# EAGLE design imsensor-v01 (EAGLE 7.5.0)
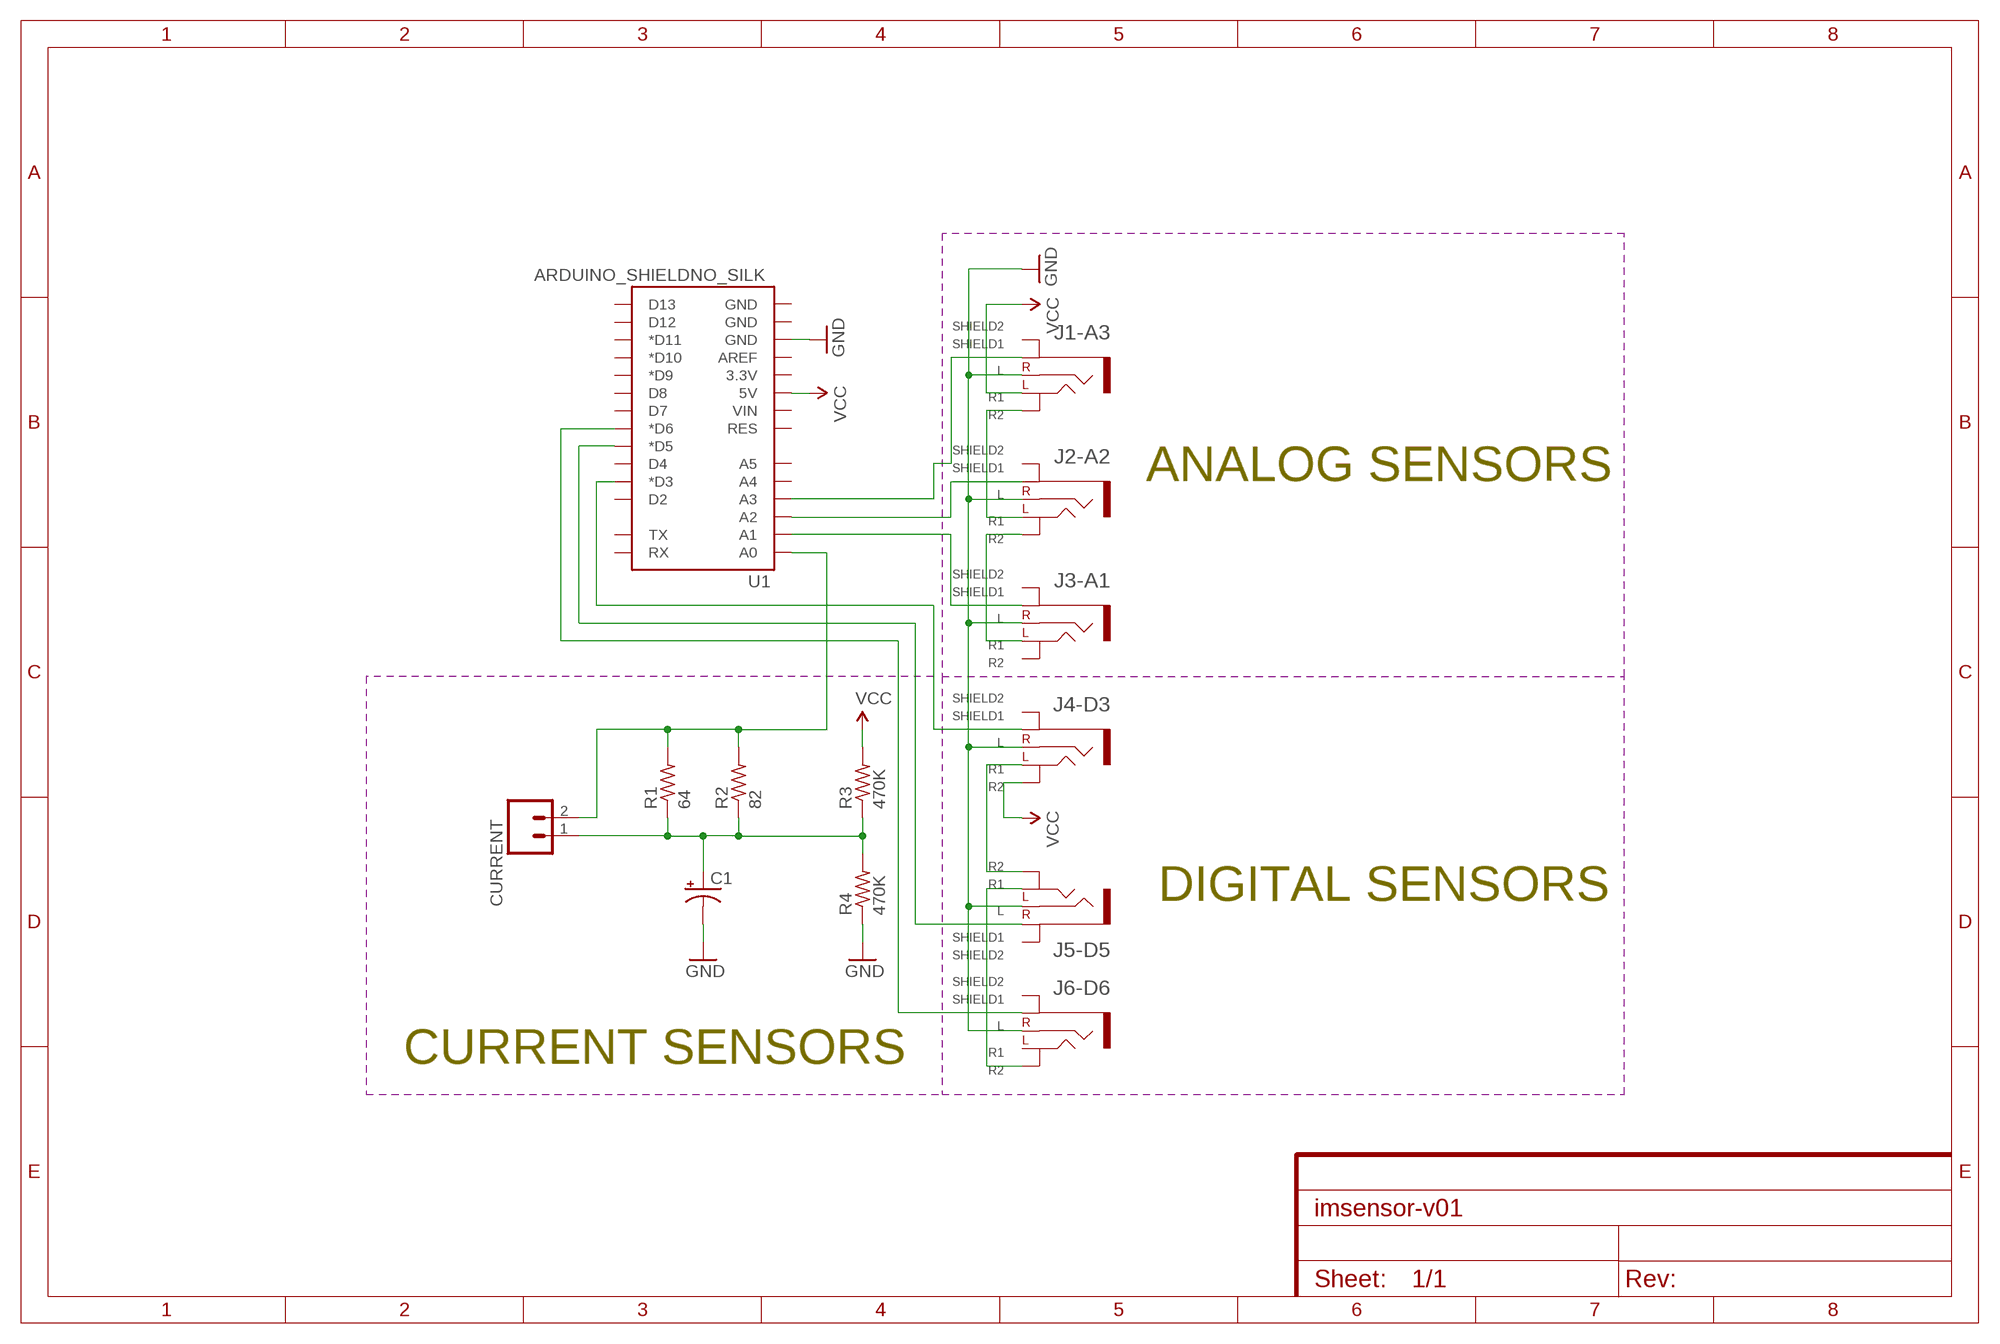
[diagram p0: schematic, sheet 1]
FRAME1 (FRAME-A4L): CNAME: IMSensorNode; CREVISION: REV A; DESIGNER: Jeferson Lima

## Parts
C1  10UF-25V-20%(PTH)  [CPOL-RADIAL-10UF-25V]
CURRENT  M02PTH  [1X02]
J1-A3  PJ-313-SPAD  [PJ-313-5PIN-SMALL]
J2-A2  PJ-313-SPAD  [PJ-313-5PIN-SMALL]
J3-A1  PJ-313-SPAD  [PJ-313-5PIN-SMALL]
J4-D3  PJ-313-SPAD  [PJ-313-5PIN-SMALL]
J5-D5  PJ-313-SPAD  [PJ-313-5PIN-SMALL]
J6-D6  PJ-313-SPAD  [PJ-313-5PIN-SMALL]
R1  64  R-US_0207/10  [0207/10]
R2  82  R-US_0207/10  [0207/10]
R3  470K  R-US_0207/10  [0207/10]
R4  470K  R-US_0207/10  [0207/10]
U1  ARDUINO_SHIELDNO_SILK  [DUEMILANOVE_VIAS]

## Nets
GND: C1.2(-) J1-A3.2(R) J2-A2.2(R) J3-A1.2(R) J4-D3.2(R) J5-D5.2(R) J6-D6.2(R) R4.1 U1.GND@2(GND)
J5: J6-D6.1.1(SHIELD1) U1.D6(*D6)
N$1: J1-A3.3.2(L2) J2-A2.3.1(L1)
N$2: J2-A2.3.2(L2) J3-A1.3.1(L1)
N$3: J1-A3.1.1(SHIELD1) U1.A3
N$4: J2-A2.1.1(SHIELD1) U1.A2
N$5: J3-A1.1.1(SHIELD1) U1.A1
N$6: J5-D5.1.1(SHIELD1) U1.D5(*D5)
N$7: J4-D3.3.1(L1) J5-D5.3.2(L2)
N$8: J4-D3.1.1(SHIELD1) U1.D3(*D3)
N$9: J5-D5.3.1(L1) J6-D6.3.2(L2)
N$10: CURRENT.2 R1.2 R2.2 U1.A0
N$11: C1.1(+) CURRENT.1 R1.1 R2.1 R3.1 R4.2
VCC: J1-A3.3.1(L1) J4-D3.3.2(L2) R3.2 U1.5V
Unconnected: J1-A3.1.2(SHIELD2) J2-A2.1.2(SHIELD2) J3-A1.1.2(SHIELD2) J3-A1.3.2(L2) J4-D3.1.2(SHIELD2) J5-D5.1.2(SHIELD2) J6-D6.1.2(SHIELD2) J6-D6.3.1(L1) U1.3.3V U1.A4 U1.A5 U1.AREF U1.D2 U1.D4 U1.D7 U1.D8 U1.D9(*D9) U1.D10(*D10) U1.D11(*D11) U1.D12 U1.D13 U1.GND@0(GND) U1.GND@1(GND) U1.RES U1.RX U1.TX U1.VIN

## Notes on the sheet
- ANALOG SENSORS
- DIGITAL SENSORS
- CURRENT SENSORS

## Library data of the parts
C1 = SparkFun-Capacitors:10UF-25V-20%(PTH): CAP-08440; PROD_ID: CAP-08440
CURRENT = SparkFun-Connectors:M02: Standard 2-pin 0.1" header. Use with - straight break away headers ( PRT-00116) - right angle break away headers (PRT-00553) - swiss pins (PRT-00743) - machine pins (PRT-00117) - female headers (PRT-00115) Molex polarized connector foot print use with: PRT-08233 with associated crimp pins and housings. 2.54_SCREWTERM for use with PRT-10571. 3.5mm Screw Terminal footprints for PRT-08084 5mm Screw Terminal footprints for use with PRT-08432
J1-A3 J2-A2 J3-A1 J4-D3 J5-D5 J6-D6 = salvador-parts:PJ-313-SPAD: PJ-313 with octagon pads PJ-313 with small octagon pads, good for projects which need small footprints
R1-R4 = resistor:R-US_: RESISTOR, American symbol
U1 = SparkFun-Boards:ARDUINO_SHIELD: Arduino shield footprint

## Board
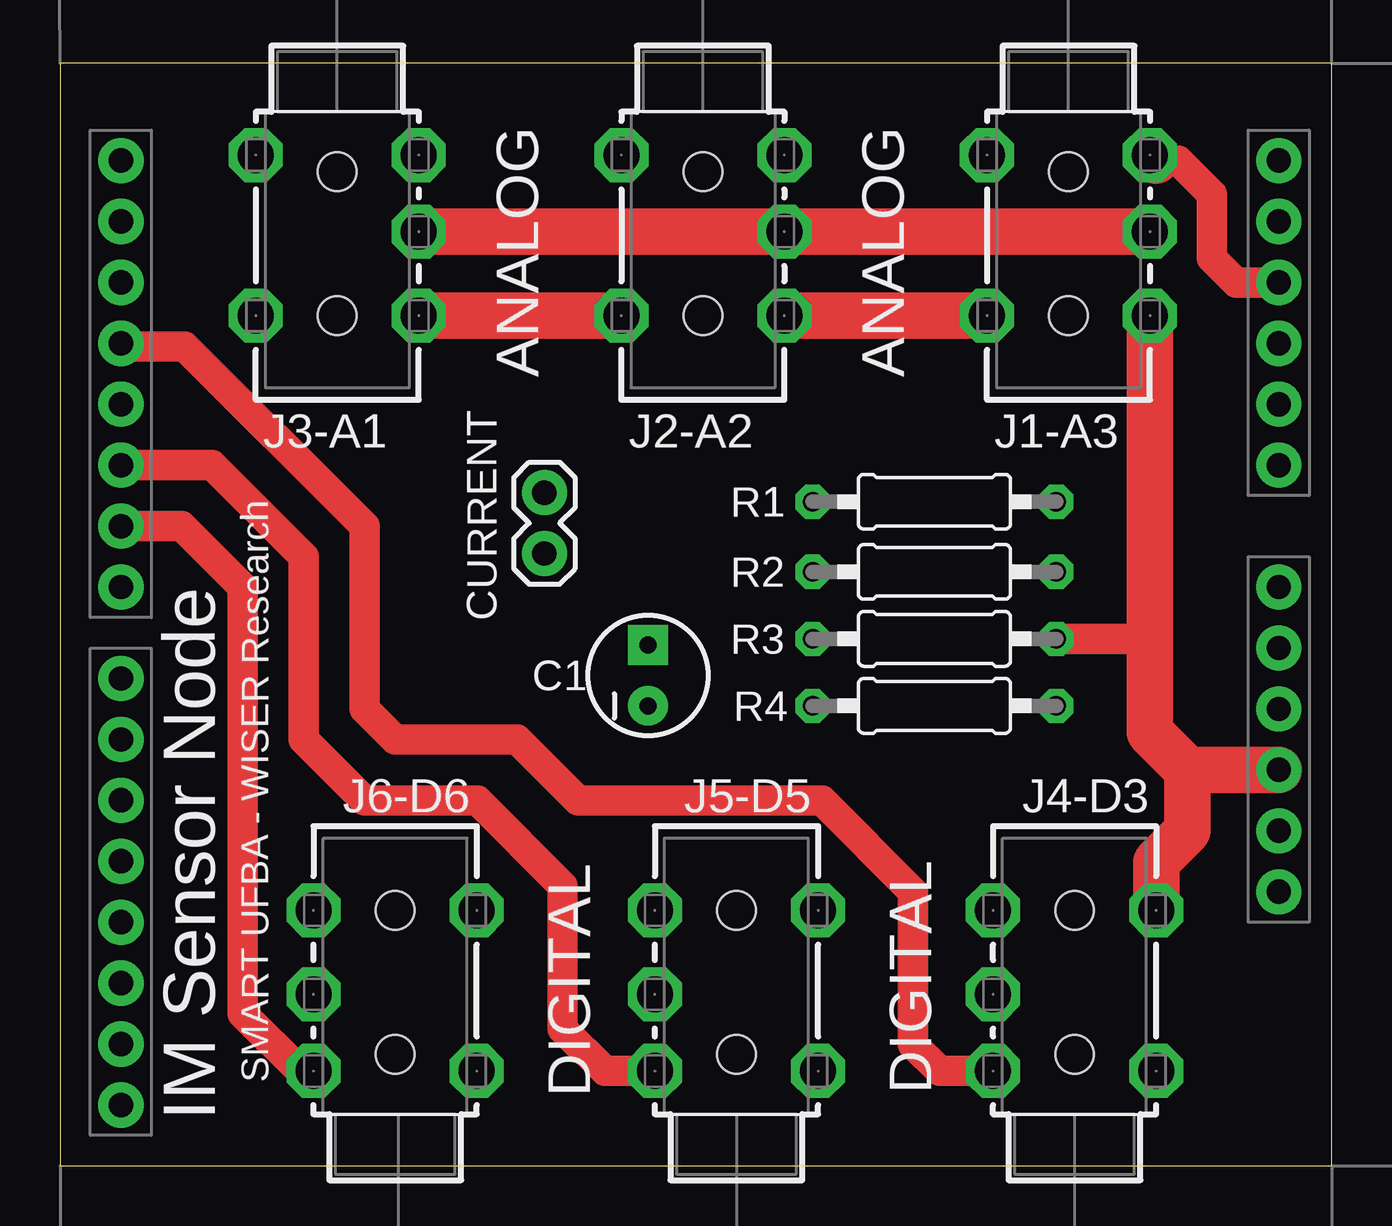
[diagram p1: board, top side]
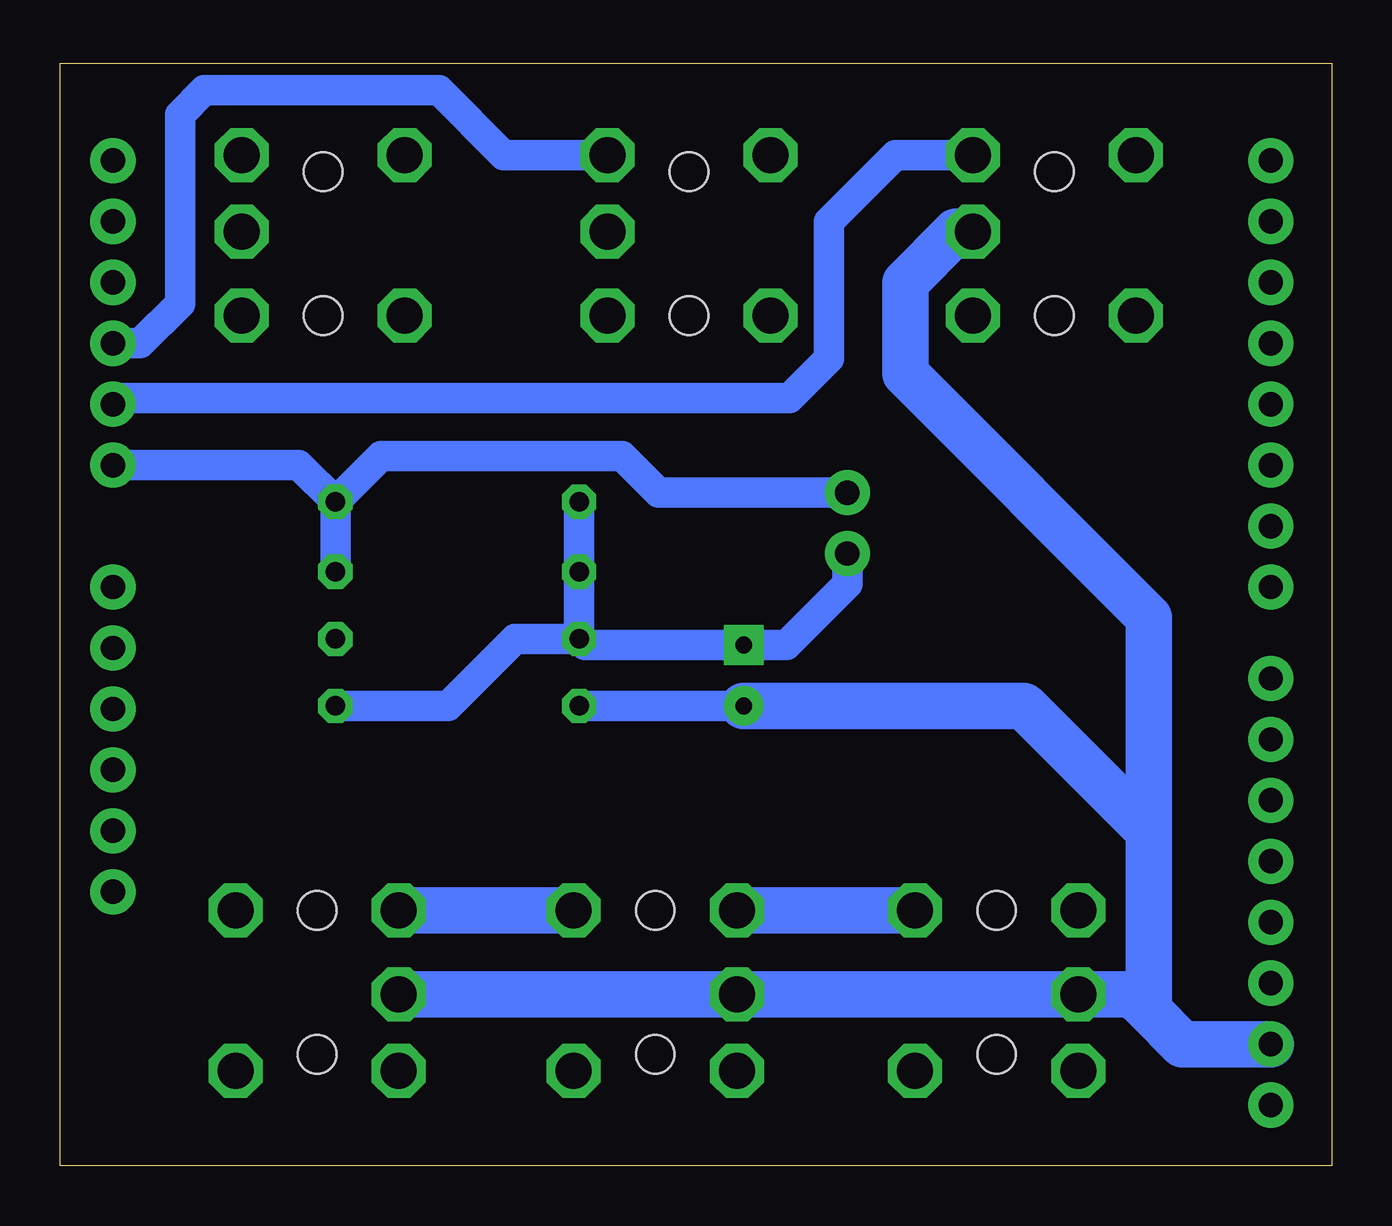
[diagram p2: board, bottom side, seen from below]

Size 53.01 x 45.96 mm. Coordinates in mm from the lower left corner, seen from the top.
Outline: 0,0 53.01,0 53.01,45.96 0,45.96 0,0
Copper layers (1*16): Top 0.035mm / dielectric 1.5mm / Bottom 0.035mm
Design rules "SparkFun": minimum track width 8mil, minimum drill 20mil, track to track 8mil, track to pad 8mil, pad to pad 8mil, via to via 8mil, smd to smd 8mil, copper to edge 10mil, drill to drill 8mil, minimum pad ring 12mil, minimum via ring 10mil, stop-mask expansion 4mil, vias tented up to drill 25mil, thermal gap 10mil

### Footprints (pad centres in the part's own frame; a part is rotated, then mirrored left to right if it is on the bottom)
CPOL-RADIAL-10UF-25V = drill 0.7 pad 1.651 square: 1 1.27,0 | drill 0.7 pad 1.651: 2 -1.27,0
1X02 = drill 1.016 pad 1.88: 1 0,0; 2 2.54,0
PJ-313-5PIN-SMALL = drill 1.5 octagon: 1.1 1.8,3.4; 1.2 1.8,-3.4; 2 5,3.4; 3.1 8.5,3.4; 3.2 8.5,-3.4 | hole 1.6: 2.5,0; 8.5,0
0207/10 = drill 0.813 octagon: 1 -5.08,0; 2 5.08,0
DUEMILANOVE_VIAS = drill 1.016 pad 1.88: 3.3V 50.8,13.97; 5V 50.8,16.51; A0 50.8,29.21; A1 50.8,31.75; A2 50.8,34.29; A3 50.8,36.83; A4 50.8,39.37; A5 50.8,41.91; AREF 2.54,2.54; D2 2.54,36.83; D3 2.54,34.29; D4 2.54,31.75; D5 2.54,29.21; D6 2.54,26.67; D7 2.54,24.13; D8 2.54,20.32; D9 2.54,17.78; D10 2.54,15.24; D11 2.54,12.7; D12 2.54,10.16; D13 2.54,7.62; GND@0 50.8,19.05; GND@1 50.8,21.59; GND@2 2.54,5.08; RES 50.8,11.43; RX 2.54,41.91; TX 2.54,39.37; VIN 50.8,24.13

### Placement (x,y rotation side)
C1  24.51,20.45 90 top
CURRENT  20.19,25.53 90 top
J1-A3  42.04,43.94 270 top
J2-A2  26.8,43.94 270 top
J3-A1  11.56,43.94 270 top
J4-D3  42.29,2.16 90 top
J5-D5  28.19,2.16 90 top
J6-D6  13.97,2.16 90 top
R1  36.45,27.69 0 top
R2  36.45,24.77 0 top
R3  36.45,21.97 0 top
R4  36.45,19.18 0 top
U1  0,0 0 top

### Tracks (layer width: path | path; a pad name or v marks a point on that pad's centre or on a via)
GND
  Top 1.93: J3-A1.2 J2-A2.2 J1-A3.2
  Bottom 1.27: R4.1 C1.2
  Bottom 1.93: J4-D3.2 J5-D5.2 J6-D6.2 8.3,7.16 7.62,6.48 | 7.62,6.48 6.22,5.08 U1.GND@2 | J3-A1.2 15.67,38.94 17.78,36.83 17.78,33.02 7.62,22.86 7.62,13.97 | 7.62,13.97 7.62,6.48 | C1.2 12.83,19.18 7.62,13.97
J5
  Top 1.27: J6-D6.1.1 10.01,3.96 7.62,6.35 7.62,24.13 5.08,26.67 U1.D6
N$1
  Top 1.93: J2-A2.3.1 J1-A3.3.2
N$2
  Top 1.93: J2-A2.3.2 J3-A1.3.1
N$3
  Top 1.27: 45.67,41.91 46.61,41.91 48.01,40.51 48.01,37.85 49.02,36.83 U1.A3
  Top 1.93: 45.67,41.91 J1-A3.1.1
N$4
  Bottom 1.27: J2-A2.1.1 34.52,42.14 37.21,44.83 46.99,44.83 48.01,43.81 48.01,35.94 49.66,34.29 U1.A2
N$5
  Bottom 1.27: J3-A1.1.1 18.18,42.14 20.95,39.37 20.95,33.66 22.61,32 50.55,32 U1.A1
N$6
  Top 1.27: J5-D5.1.1 22.71,3.96 20.95,5.71 20.95,11.68 17.4,15.24 12.7,15.24 10.16,17.78 10.16,25.4 6.35,29.21 U1.D5
N$7
  Bottom 1.93: J4-D3.3.1 J5-D5.3.2
N$8
  Top 1.27: J4-D3.1.1 36.68,3.96 35.56,5.08 35.56,11.43 31.75,15.24 21.59,15.24 19.05,17.78 13.97,17.78 12.7,19.05 12.7,26.67 5.21,34.16 2.67,34.16 U1.D3
N$9
  Bottom 1.93: J5-D5.3.1 J6-D6.3.2
N$10
  Bottom 1.27: R2.2 R1.2 | U1.A0 43.05,29.21 R1.2 | R1.2 39.62,29.59 29.59,29.59 28.07,28.07 CURRENT.2
N$11
  Bottom 1.27: R3.1 31.11,21.72 C1.1 22.73,21.72 20.19,24.26 CURRENT.1 | R4.2 36.83,19.18 34.04,21.97 R3.1 | R3.1 R2.1 R1.1
VCC
  Top 1.27: R3.2 45.06,21.97 45.44,21.59
  Top 1.93: 46.99,16.51 U1.5V | J4-D3.3.2 45.69,12.67 46.99,13.97 46.99,16.51 | J1-A3.3.1 45.44,21.59 45.44,18.06 46.99,16.51

### Text on the board
tPlace: ANALOG | ANALOG | SMART UFBA - WISER Research | DIGITAL | DIGITAL | IM Sensor Node